# Altium schematic sheet 3.22.SchDoc
size A4
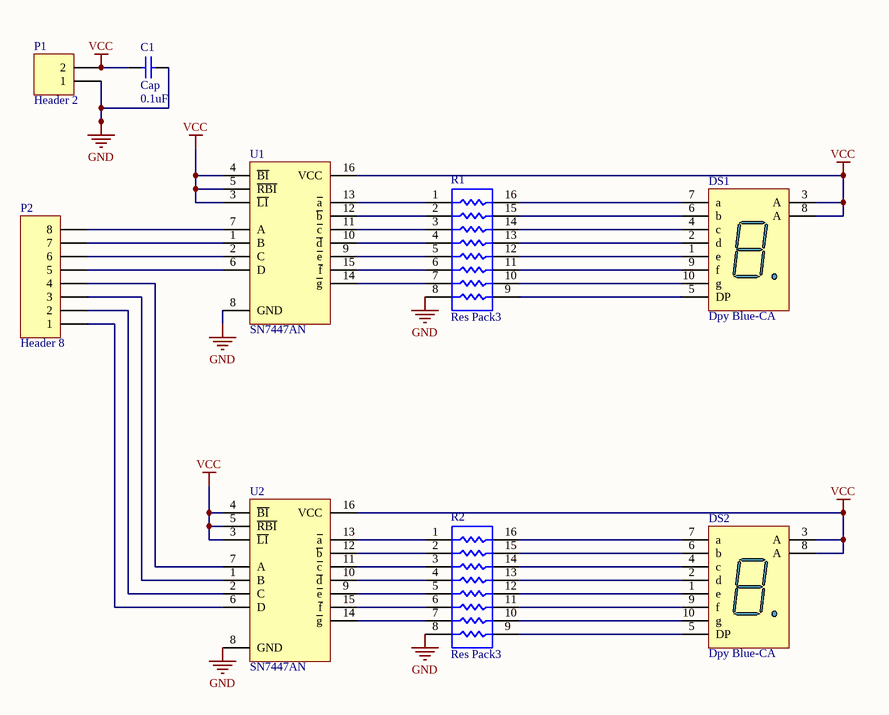
[diagram p0: 3.22.SchDoc]

## Parts
C1  Cap  value 0.1uF  [RAD-0.3]
DS1  Dpy Blue-CA  [LEDDIP-10/C15.24RHD]
DS2  Dpy Blue-CA  [LEDDIP-10/C15.24RHD]
P1  Header 2  [HDR1X2]
P2  Header 8  [HDR1X8]
R1  Res Pack3  [SOIC127P600-16N]
R2  Res Pack3  [SOIC127P600-16N]
U1  SN7447AN  [PCBComponent_1]
U2  SN7447AN  [PCBComponent_1]

## Nets
GND: C1.2 P1.1 R1.8 R2.8 U1.8(GND) U2.8(GND)
VCC: C1.1 DS1.3(A) DS1.8(A) DS2.3(A) DS2.8(A) P1.2 U1.3(~{LI}) U1.4(~{BI}) U1.5(~{RBI}) U1.16(VCC) U2.3(~{LI}) U2.4(~{BI}) U2.5(~{RBI}) U2.16(VCC)
NetDS1_1: DS1.1(e) R1.12
NetDS1_2: DS1.2(d) R1.13
NetDS1_4: DS1.4(c) R1.14
NetDS1_5: DS1.5(DP) R1.9
NetDS1_6: DS1.6(b) R1.15
NetDS1_7: DS1.7(a) R1.16
NetDS1_9: DS1.9(f) R1.11
NetDS1_10: DS1.10(g) R1.10
NetDS2_1: DS2.1(e) R2.12
NetDS2_2: DS2.2(d) R2.13
NetDS2_4: DS2.4(c) R2.14
NetDS2_5: DS2.5(DP) R2.9
NetDS2_6: DS2.6(b) R2.15
NetDS2_7: DS2.7(a) R2.16
NetDS2_9: DS2.9(f) R2.11
NetDS2_10: DS2.10(g) R2.10
NetP2_1: P2.1 U2.6(D)
NetP2_2: P2.2 U2.2(C)
NetP2_3: P2.3 U2.1(B)
NetP2_4: P2.4 U2.7(A)
NetP2_5: P2.5 U1.6(D)
NetP2_6: P2.6 U1.2(C)
NetP2_7: P2.7 U1.1(B)
NetP2_8: P2.8 U1.7(A)
NetR1_1: R1.1 U1.13(~{a})
NetR1_2: R1.2 U1.12(~{b})
NetR1_3: R1.3 U1.11(~{c})
NetR1_4: R1.4 U1.10(~{d})
NetR1_5: R1.5 U1.9(~{e})
NetR1_6: R1.6 U1.15(~{f})
NetR1_7: R1.7 U1.14(~{g})
NetR2_1: R2.1 U2.13(~{a})
NetR2_2: R2.2 U2.12(~{b})
NetR2_3: R2.3 U2.11(~{c})
NetR2_4: R2.4 U2.10(~{d})
NetR2_5: R2.5 U2.9(~{e})
NetR2_6: R2.6 U2.15(~{f})
NetR2_7: R2.7 U2.14(~{g})

## Library data of the parts
C1 = Cap: Capacitor; Published: 8-Jun-2000; LatestRevisionDate: 17-Jul-2002; LatestRevisionNote: Re-released for DXP Platform.; PackageReference: RAD-0.3; Publisher: Altium Limited
DS1 DS2 = Dpy Blue-CA: 14.2 mm General Purpose Blue 7-Segment Display: CA, RH DP, Gray Surface; MinimumIntensity: 2020 ucd; Note: IF = 10 mA; Published: 8-Jun-2000; LatestRevisionDate: 17-Dec-2003; LatestRevisionNote: Schematic revised, PCB Footprint replaced.; DatasheetVersion: 24-Sep-2002; PackageVersion: 24-Sep-2002; PackageReference: H; Publisher: Altium Limited; Colour: Blue; ComponentLink1Description: Manufacturer Link; ComponentLink1URL: http://www.agilent.com/
P1 = Header 2: Header, 2-Pin; LatestRevisionDate: 17-Jul-2002; LatestRevisionNote: Re-released for DXP Platform.; Publisher: Altium Limited
P2 = Header 8: Header, 8-Pin; LatestRevisionDate: 17-Jul-2002; LatestRevisionNote: Re-released for DXP Platform.; Publisher: Altium Limited
R1 R2 = Res Pack3: Isolated Resistor Network; Value: 330; Published: 24-Mar-1999; LatestRevisionDate: 29-May-2009; LatestRevisionNote: IPC-7351 Footprint Added.; PackageReference: SO-16; Publisher: Altium Limited; PackageDescription: 16-Pin Small Outline Integrated Circuit 1.27 mm Pitch; Code_JEDEC: MS-012-AC; Code_IPC: SOIC127P600-16
U1 U2 = SN7447